# EAGLE design NHK_bldc (EAGLE 9.6.2)
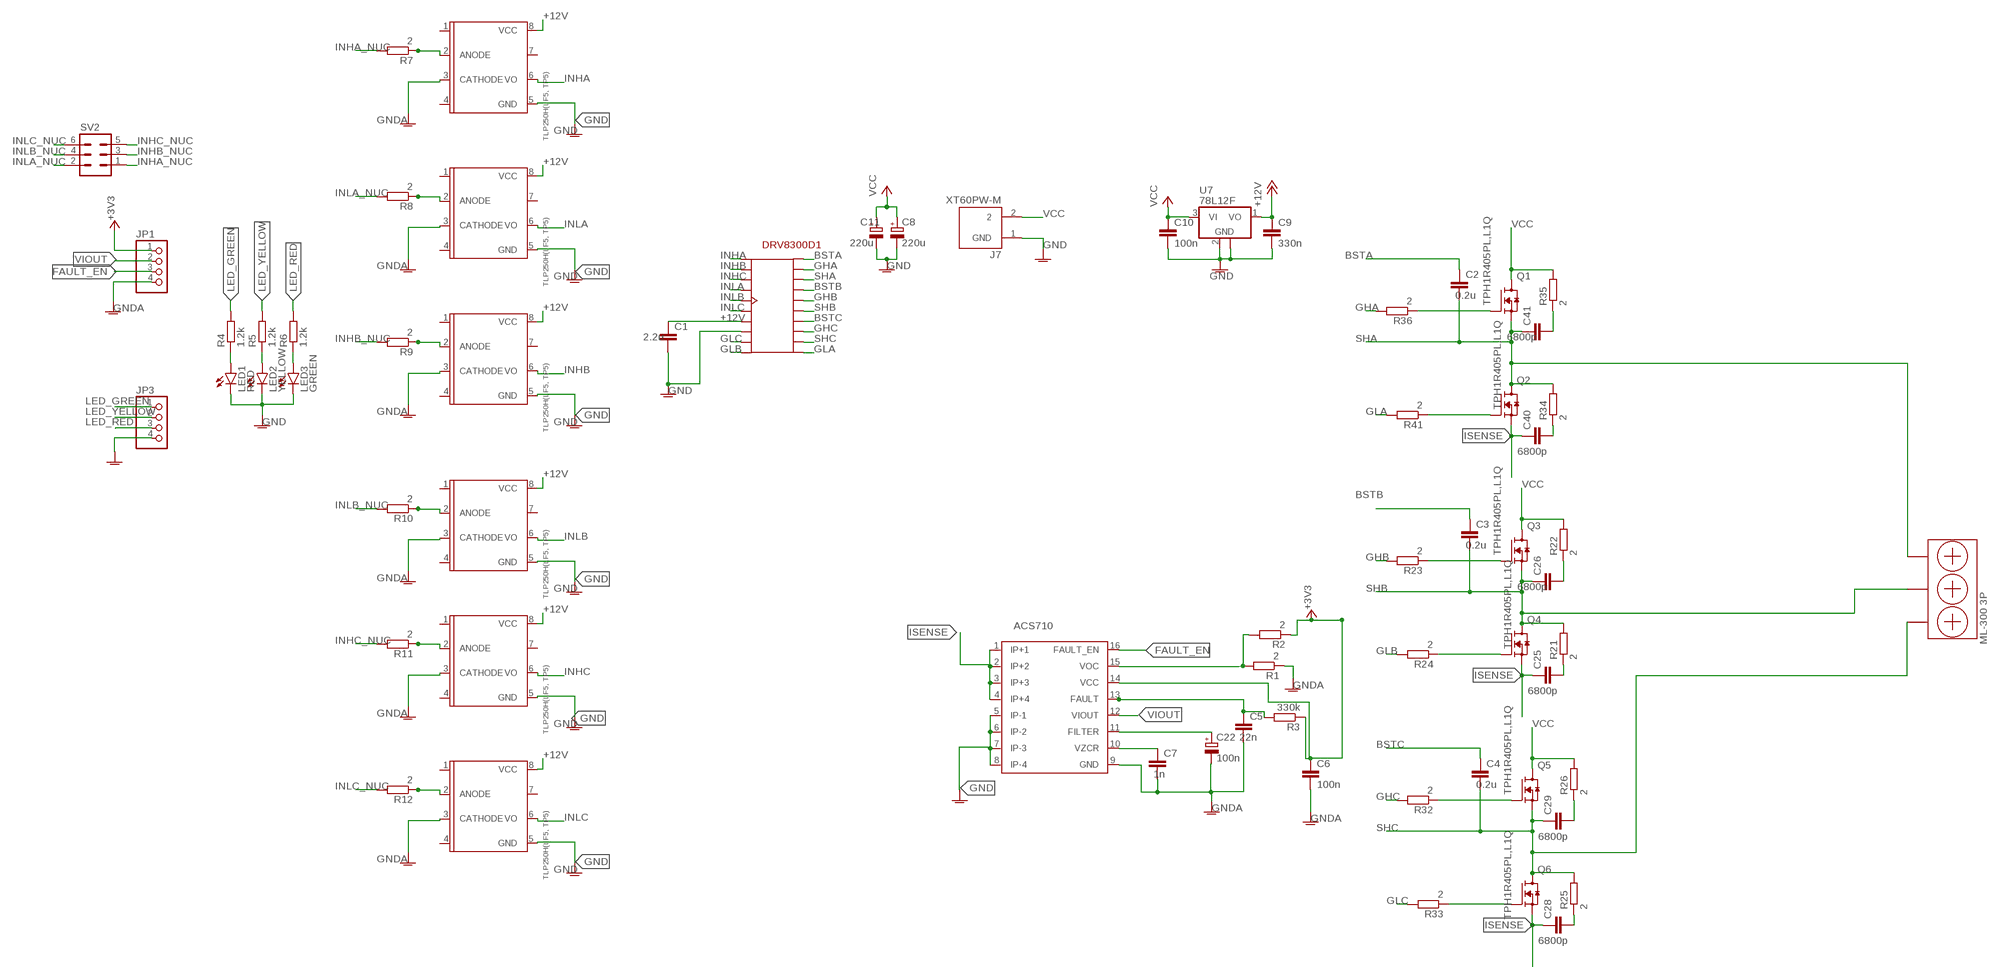
[diagram p0: schematic, sheet 1]

## Parts
C1  2.2u  C-EUC1206  [C1206]
C2  0.2u  C-EUC1206  [C1206]
C3  0.2u  C-EUC1206  [C1206]
C4  0.2u  C-EUC1206  [C1206]
C5  22n  C-EUC0603  [C0603]
C6  100n  C-EUC0603  [C0603]
C7  1n  C-EUC0603  [C0603]
C8  220u  CPOL-EUE5-10.5  [E5-10,5]
C9  330n  C-EUC0603  [C0603]
C10  100n  C-EUC0603  [C0603]
C11  220u  CPOL-EUE5-10.5  [E5-10,5]
C22  100n  CPOL-EUE2.5-5  [E2,5-5]
C25  6800p  C-EUC0603  [C0603]
C26  6800p  C-EUC0603  [C0603]
C28  6800p  C-EUC0603  [C0603]
C29  6800p  C-EUC0603  [C0603]
C40  6800p  C-EUC0603  [C0603]
C41  6800p  C-EUC0603  [C0603]
DRV8300D1  DRV8300D  [DRV8300D]
J7  XT60PW-M  [AMASS_XT60PW-M]
JP1  PINHD-1X4  [1X04]
JP3  PINHD-1X4  [1X04]
LED1  RED  LEDCHIP-LED0603  [CHIP-LED0603]
LED2  YELLOW  LEDCHIP-LED0603  [CHIP-LED0603]
LED3  GREEN  LEDCHIP-LED0603  [CHIP-LED0603]
ML-300-3P1  ML-300-3P  [ML300-3P]
Q1  TPH1R405PL,L1Q  [SOPADVANCE]
Q2  TPH1R405PL,L1Q  [SOPADVANCE]
Q3  TPH1R405PL,L1Q  [SOPADVANCE]
Q4  TPH1R405PL,L1Q  [SOPADVANCE]
Q5  TPH1R405PL,L1Q  [SOPADVANCE]
Q6  TPH1R405PL,L1Q  [SOPADVANCE]
R1  2  R-EU_R0603  [R0603]
R2  2  R-EU_R0603  [R0603]
R3  330k  R-EU_R0603  [R0603]
R4  1.2k  R-EU_R0603  [R0603]
R5  1.2k  R-EU_R0603  [R0603]
R6  1.2k  R-EU_R0603  [R0603]
R7  2  R-EU_R0603  [R0603]
R8  2  R-EU_R0603  [R0603]
R9  2  R-EU_R0603  [R0603]
R10  2  R-EU_R0603  [R0603]
R11  2  R-EU_R0603  [R0603]
R12  2  R-EU_R0603  [R0603]
R21  2  R-EU_R0603  [R0603]
R22  2  R-EU_R0603  [R0603]
R23  2  R-EU_R0603  [R0603]
R24  2  R-EU_R0603  [R0603]
R25  2  R-EU_R0603  [R0603]
R26  2  R-EU_R0603  [R0603]
R32  2  R-EU_R0603  [R0603]
R33  2  R-EU_R0603  [R0603]
R34  2  R-EU_R0603  [R0603]
R35  2  R-EU_R0603  [R0603]
R36  2  R-EU_R0603  [R0603]
R41  2  R-EU_R0603  [R0603]
SV2  MA03-2  [MA03-2]
U7  78L12F  [SOT89]
U8  TLP250H(LF5,TP5)  [TLP250H(LF5,TP5)]
U9  TLP250H(LF5,TP5)  [TLP250H(LF5,TP5)]
U10  TLP250H(LF5,TP5)  [TLP250H(LF5,TP5)]
U11  TLP250H(LF5,TP5)  [TLP250H(LF5,TP5)]
U12  TLP250H(LF5,TP5)  [TLP250H(LF5,TP5)]
U14  TLP250H(LF5,TP5)  [TLP250H(LF5,TP5)]
U$1  ACS710  [ACS710]

## Nets
+3V3: C6.1 JP1.1 R2.1 R3.1 U$1.14(VCC)
+12V: C1.1 C9.1 DRV8300D1.GVDD U7.1(VO) U8.8(VCC) U9.8(VCC) U10.8(VCC) U11.8(VCC) U12.8(VCC) U14.8(VCC)
AHG1: Q1.4(G) R36.1
AHG3: Q3.4(G) R23.1
AHG4: Q5.4(G) R32.1
ALG1: Q2.4(G) R41.1
ALG3: Q4.4(G) R24.1
ALG4: Q6.4(G) R33.1
BSTA: C2.1 DRV8300D1.BSTA
BSTB: C3.1 DRV8300D1.BSTB
BSTC: C4.1 DRV8300D1.BSTC
FAULT_EN: JP1.3 U$1.16(FAULT_EN)
GHA: DRV8300D1.GHA R36.2
GHB: DRV8300D1.GHB R23.2
GHC: DRV8300D1.GHC R32.2
GLA: DRV8300D1.GLA R41.2
GLB: DRV8300D1.GLB R24.2
GLC: DRV8300D1.GLC R33.2
GND: C1.2 C8.- C9.2 C10.2 C11.- DRV8300D1.GND J7.1(GND) LED1.C LED2.C LED3.C U7.2(GND) U7.2@1(GND) U8.5(GND) U9.5(GND) U10.5(GND) U11.5(GND) U12.5(GND) U14.5(GND) U$1.5(IP-1) U$1.6(IP-2) U$1.7(IP-3) U$1.8(IP-4) ; supply symbol labelled GNDA
GNDA: C5.2 C6.2 C7.2 C22.- JP1.4 JP3.4 R1.1 U8.3(CATHODE) U9.3(CATHODE) U10.3(CATHODE) U11.3(CATHODE) U12.3(CATHODE) U14.3(CATHODE) U$1.9(GND)
INHA: DRV8300D1.INHA U8.6(VO)
INHA_NUC: R7.2 SV2.1
INHB: DRV8300D1.INHB U10.6(VO)
INHB_NUC: R9.2 SV2.3
INHC: DRV8300D1.INHC U12.6(VO)
INHC_NUC: R11.2 SV2.5
INLA: DRV8300D1.INLA U9.6(VO)
INLA_NUC: R8.2 SV2.2
INLB: DRV8300D1.INLB U11.6(VO)
INLB_NUC: R10.2 SV2.4
INLC: DRV8300D1.INLC U14.6(VO)
INLC_NUC: R12.2 SV2.6
ISENSE: C25.1 C28.1 C40.1 Q2.1(S) Q2.2(S) Q2.3(S) Q4.1(S) Q4.2(S) Q4.3(S) Q6.1(S) Q6.2(S) Q6.3(S) U$1.1(IP+1) U$1.2(IP+2) U$1.3(IP+3) U$1.4(IP+4)
LED_GREEN: JP3.1 R4.2
LED_RED: JP3.3 R6.2
LED_YELLOW: JP3.2 R5.2
N$1: LED1.A R4.1
N$2: LED2.A R5.1
N$3: R1.2 R2.2 U$1.15(VOC)
N$4: C5.1 R3.2 U$1.13(FAULT)
N$5: C7.1 U$1.10(VZCR)
N$6: LED3.A R6.1
N$7: R7.1 U8.2(ANODE)
N$8: R8.1 U9.2(ANODE)
N$9: R9.1 U10.2(ANODE)
N$10: R10.1 U11.2(ANODE)
N$11: R11.1 U12.2(ANODE)
N$12: R12.1 U14.2(ANODE)
N$17: C22.+ U$1.11(FILTER)
N$36: C25.2 R21.1
N$37: C26.2 R22.1
N$39: C28.2 R25.1
N$40: C29.2 R26.1
N$42: C40.2 R34.1
N$43: C41.2 R35.1
SHA: C2.2 C41.1 DRV8300D1.SHA ML-300-3P1.P$1 Q1.1(S) Q1.2(S) Q1.3(S) Q2.5(D) Q2.6(D) Q2.7(D) Q2.8(D) Q2.9(D) R34.2
SHB: C3.2 C26.1 DRV8300D1.SHB ML-300-3P1.P$3 Q3.1(S) Q3.2(S) Q3.3(S) Q4.5(D) Q4.6(D) Q4.7(D) Q4.8(D) Q4.9(D) R21.2
SHC: C4.2 C29.1 DRV8300D1.SHC ML-300-3P1.P$5 Q5.1(S) Q5.2(S) Q5.3(S) Q6.5(D) Q6.6(D) Q6.7(D) Q6.8(D) Q6.9(D) R25.2
VCC: C8.+ C10.1 C11.+ J7.2 Q1.5(D) Q1.6(D) Q1.7(D) Q1.8(D) Q1.9(D) Q3.5(D) Q3.6(D) Q3.7(D) Q3.8(D) Q3.9(D) Q5.5(D) Q5.6(D) Q5.7(D) Q5.8(D) Q5.9(D) R22.2 R26.2 R35.2 U7.3(VI)
VIOUT: JP1.2 U$1.12(VIOUT)
Unconnected: U8.1 U8.4 U8.7 U9.1 U9.4 U9.7 U10.1 U10.4 U10.7 U11.1 U11.4 U11.7 U12.1 U12.4 U12.7 U14.1 U14.4 U14.7

## Library data of the parts
C1-C7 C9 C10 C25 C26 C28 C29 C40 C41 = rcl:C-EU: CAPACITOR, European symbol; SPICEPREFIX: C
C8 C11 C22 = rcl:CPOL-EU: POLARIZED CAPACITOR, European symbol; SPICEPREFIX: C
DRV8300D1 = DRV8300D:DRV8300D
J7 = con-xt:XT60PW-M; AVAILABILITY: Unavailable; MF: AMASS; MP: XT60PW-M; PACKAGE: Package Analog Devices; PRICE: None
JP1 JP3 = pinhead:PINHD-1X4: PIN HEADER
LED1-LED3 = led:LED: LED OSRAM: - CHIPLED LG R971, LG N971, LY N971, LG Q971, LY Q971, LO R971, LY R971 LH N974, LH R974 LS Q976, LO Q976, LY Q976 LO Q996 - Hyper CHIPLED LW Q18S LB Q993, LB Q99A, LB R99A - SideLED LS A670, LO A670, LY A670, LG A670, LP A670 LB A673, LV A673, LT A673, LW A673 LH A674 LY A675 LS A676, LA A676, LO A676, LY A676, LW A676 LS A679, LY A679, LG A679 - Hyper Micro SIDELED® LS Y876, LA Y876, LO Y876, LY Y876 LT Y87S - SmartLED LW L88C, LW L88S LB L89C, LB L89S, LG L890 LS L89K, LO L89K, LY L89K LS L896, LA L896, LO L896, LY L896 - TOPLED LS T670, LO T670, LY T670, LG T670, LP T670 LSG T670, LSP T670, LSY T670, LOP T670, LYG T670 LG T671, LOG T671, LSG T671 LB T673, LV T673, LT T673, LW T673 LH T674 LS T676, LA T676, LO T676, LY T676, LB T676, LH T676, LSB T676, LW T676 LB T67C, LV T67C, LT T67C, LS T67K, LO T67K, LY T67K, LW E67C LS E67B, LA E67B, LO E67B, LY E67B, LB E67C, LV E67C, LT E67C LW T67C LS T679, LY T679, LG T679 LS T770, LO T770, LY T770, LG T770, LP T770 LB T773, LV T773, LT T773, LW T773 LH T774 LS E675, LA E675, LY E675, LS T675 LS T776, LA T776, LO T776, LY T776, LB T776 LHGB T686 LT T68C, LB T68C - Hyper Mini TOPLED® LB M676 - Mini TOPLED Santana® LG M470 LS M47K, LO M47K, LY M47K Source: http://www.osram.convergy.de LUXEON: - LUMILED® LXK2-PW12-R00, LXK2-PW12-S00, LXK2-PW14-U00, LXK2-PW14-V00 LXK2-PM12-R00, LXK2-PM12-S00, LXK2-PM14-U00 LXK2-PE12-Q00, LXK2-PE12-R00, LXK2-PE12-S00, LXK2-PE14-T00, LXK2-PE14-U00 LXK2-PB12-K00, LXK2-PB12-L00, LXK2-PB12-M00, LXK2-PB14-N00, LXK2-PB14-P00, LXK2-PB14-Q00 LXK2-PR12-L00, LXK2-PR12-M00, LXK2-PR14-Q00, LXK2-PR14-R00 LXK2-PD12-Q00, LXK2-PD12-R00, LXK2-PD12-S00 LXK2-PH12-R00, LXK2-PH12-S00 LXK2-PL12-P00, LXK2-PL12-Q00, LXK2-PL12-R00 Source: www.luxeon.com KINGBRIGHT: KA-3528ASYC Source: www.kingbright.com
ML-300-3P1 = ML-300-3P:ML-300-3P
Q1-Q6 = toshiba:TPH1R405PL,L1Q; SPICEPREFIX: Q
R1-R12 R21-R26 R32-R36 R41 = rcl:R-EU_: RESISTOR, European symbol; SPICEPREFIX: R
SV2 = con-lstb:MA03-2: PIN HEADER; OC_FARNELL: unknown; OC_NEWARK: unknown
U7 = linear:78L*: POSITOIV-VOLTAGE REGULATORS Output up to 100 mA Source: Datasheet <http://focus.ti.com/lit/ds/symlink/ua78l05.pdf>
U8-U12 U14 = TLP250H(LF5, TP5):TLP250H(LF5,TP5)
U$1 = ACS710:ACS710

## Net classes
1 Power: width 0.8 mm, clearance 1 mm
2 FET: width 0.1 mm, clearance 1 mm

## Board
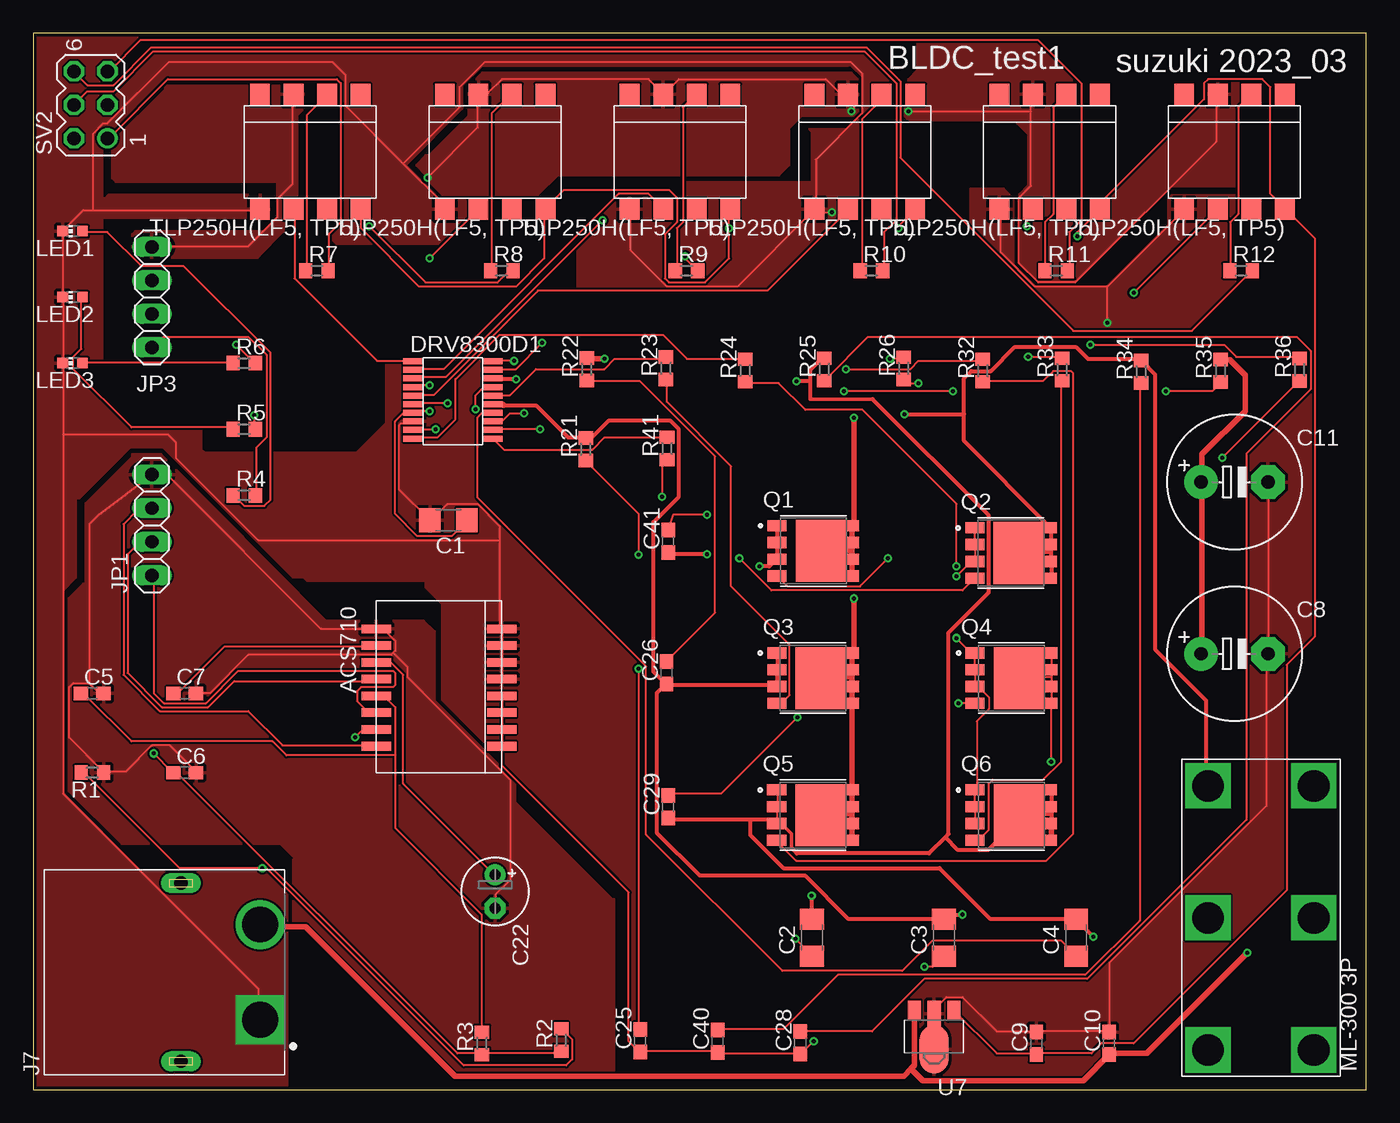
[diagram p1: board, top side]
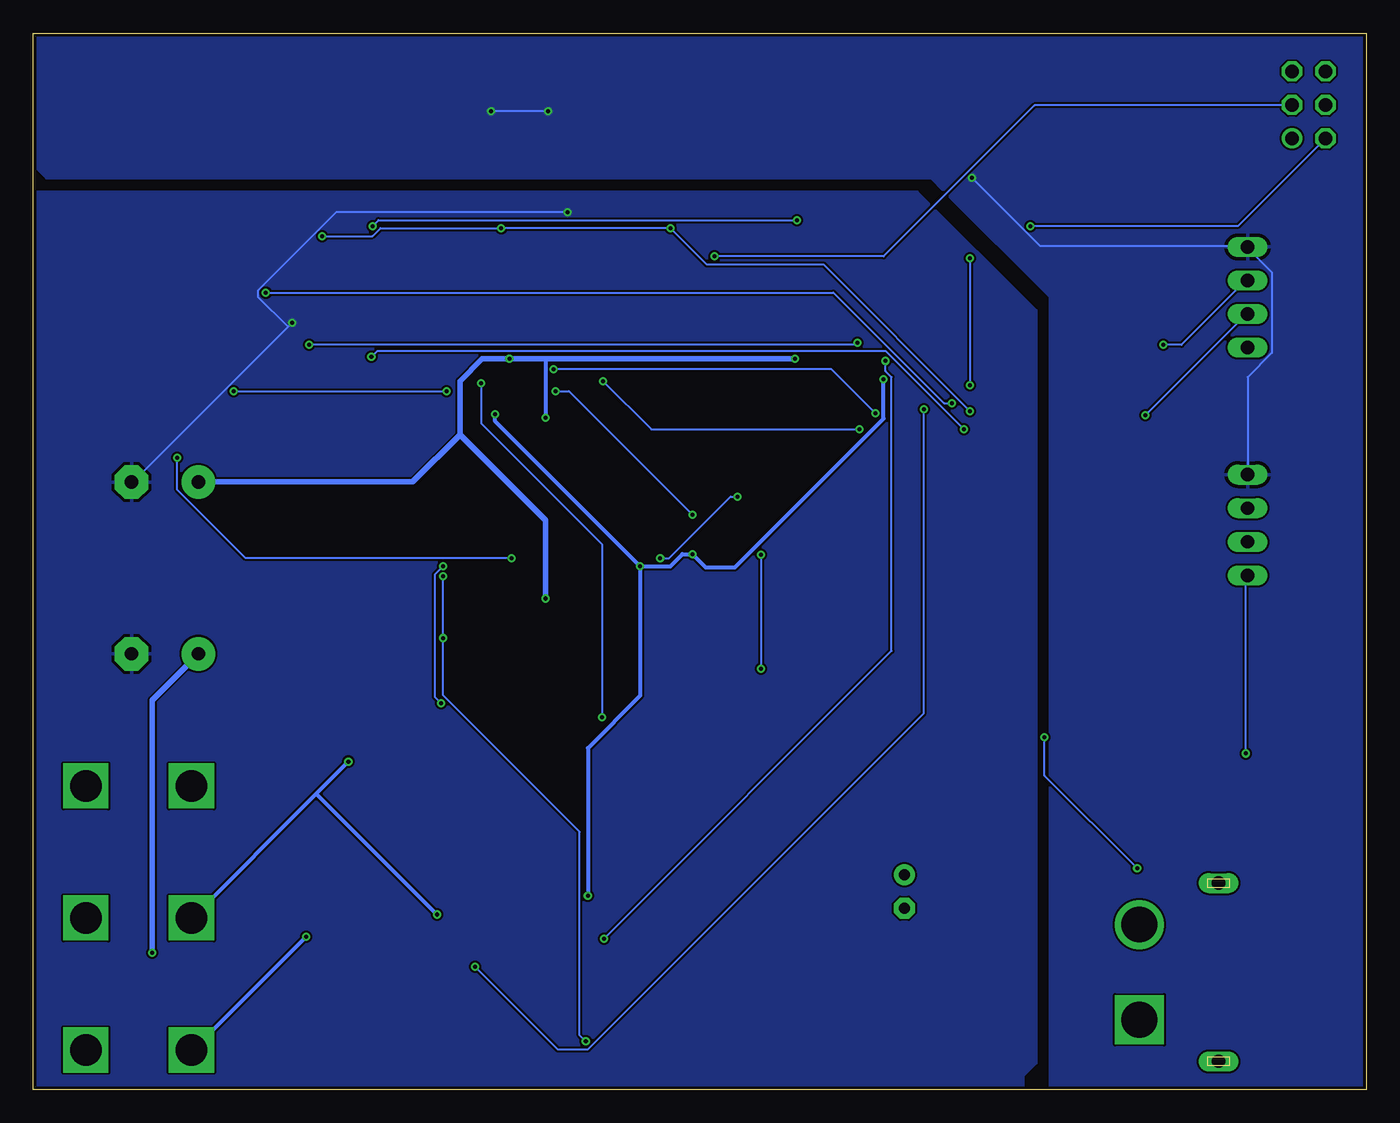
[diagram p2: board, bottom side, seen from below]

Size 101 x 80 mm. Coordinates in mm from the lower left corner, seen from the top.
Outline: 0,0 101,0 101,80 0,80 0,0
Copper layers (1*16): Top 0.035mm / dielectric 1.5mm / Bottom 0.035mm
Design rules "SeeedStudio_2layer_DRU_no_angle_20140221": minimum track width 6mil, minimum drill 12mil, track to track 6mil, track to pad 6mil, pad to pad 6mil, via to via 6mil, smd to smd 0mil, copper to edge 10mil, drill to drill 10mil, minimum pad ring 10mil, minimum via ring 6mil, stop-mask expansion 2mil, vias tented up to drill 100mil, thermal gap 10mil

### Footprints (pad centres in the part's own frame; a part is rotated, then mirrored left to right if it is on the bottom)
C1206 = smd 1.6 x 1.8: 1 -1.4,0; 2 1.4,0
C0603 = smd 1.1 x 1: 1 -0.85,0; 2 0.85,0
E5-10,5 = drill 1.016 pad 2.54: + -2.54,0 | drill 1.016 pad 2.54 octagon: - 2.54,0
E2,5-5 = drill 0.813 pad 1.6: + -1.27,0 | drill 0.813 pad 1.6 octagon: - 1.27,0
DRV8300D = smd 1.5 x 0.45: BSTA 5.25,6.325; BSTB 5.25,4.375; BSTC 5.25,2.425; GHA 5.25,5.675; GHB 5.25,3.725; GHC 5.25,1.775; GLA 5.25,0.475; GLB -0.75,0.475; GLC -0.75,1.125; GND -0.75,1.775; GVDD -0.75,2.425; INHA -0.75,6.325; INHB -0.75,5.675; INHC -0.75,5.025; INLA -0.75,4.375; INLB -0.75,3.725; INLC -0.75,3.075; SHA 5.25,5.025; SHB 5.25,3.075; SHC 5.25,1.125
AMASS_XT60PW-M = drill 2.7 square: 1 -3.6,-6 | drill 2.7: 2 3.6,-6 | drill 1 pad 1.2 long: S1 -6.75,0; S2 6.75,0
1X04 = drill 1.016 long: 1 -3.81,0; 2 -1.27,0; 3 1.27,0; 4 3.81,0
CHIP-LED0603 = smd 0.8 x 0.8: A 0,-0.75; C 0,0.75
ML300-3P = drill 2.4 square: P$1 0,0; P$2 0,8; P$3 10,0; P$4 10,8; P$5 20,0; P$6 20,8
SOPADVANCE = smd 1.45 x 0.85: 1 -2.75,1.905; 2 -2.75,0.635; 3 -2.75,-0.635; 4 -2.75,-1.905 | smd 1.05 x 0.85: 5 2.95,-1.905; 6 2.95,-0.635; 7 2.95,0.635; 8 2.95,1.905 | smd 3.75 x 4.7: 9 0.55,0
R0603 = smd 1 x 1.1: 1 -0.85,0; 2 0.85,0
MA03-2 = drill 1.016: 1 -2.54,-1.27 | drill 1.016 octagon: 2 -2.54,1.27; 3 0,-1.27; 4 0,1.27; 5 2.54,-1.27; 6 2.54,1.27
SOT89 = smd 1 x 1.5: 1 -1.499,-1.981; 3 1.499,-1.981 | smd 1 x 2: 2 0,-1.727 | smd 2.2 x 3.7: 2@1 0,0.94
TLP250H(LF5,TP5) = smd 1.5 x 1.6: 1 -3.81,-4.35; 2 -1.27,-4.35; 3 1.27,-4.35; 4 3.81,-4.35; 5 3.81,4.35; 6 1.27,4.35; 7 -1.27,4.35; 8 -3.81,4.35
ACS710 = smd 0.65 x 2.25: 1 0,0; 2 1.27,0; 3 2.54,0; 4 3.81,0; 5 5.08,0; 6 6.35,0; 7 7.62,0; 8 8.89,0; 9 8.89,9.5; 10 7.62,9.5; 11 6.35,9.5; 12 5.08,9.5; 13 3.81,9.5; 14 2.54,9.5; 15 1.27,9.5; 16 0,9.5

### Placement (x,y rotation side)
C1  31.46,43.12 180 top
C2  59,11.5 90 top
C3  69,11.5 90 top
C4  79,11.5 90 top
C5  4.5,30 0 top
C6  11.5,24 0 top
C7  11.5,30 0 top
C8  91,33 0 top
C9  76,3.5 90 top
C10  81.5,3.5 90 top
C11  91,46 0 top
C22  35,15 270 top
C25  45.99,3.69 90 top
C26  47.99,31.56 90 top
C28  58.11,3.54 90 top
C29  48.11,21.41 90 top
C40  51.86,3.65 90 top
C41  48.11,41.52 90 top
DRV8300D1  29.55,48.82 0 top
J7  11.2,8.89 90 top
JP1  9,42.75 90 top
JP3  9,60 90 top
LED1  3,65 90 top
LED2  3,60 90 top
LED3  3,55 90 top
ML-300-3P1  89,23 270 top
Q1  59.1,40.79 0 top
Q2  74.08,40.63 0 top
Q3  59.09,31.15 0 top
Q4  74.1,31.15 0 top
Q5  59.08,20.79 0 top
Q6  74.09,20.79 0 top
R1  4.5,24 180 top
R2  40,3.75 90 top
R3  34,3.5 90 top
R4  16,45 0 top
R5  16,50 0 top
R6  16,55 0 top
R7  21.5,62 0 top
R8  35.5,62 0 top
R9  49.5,62 0 top
R10  63.5,62 0 top
R11  77.5,62 0 top
R12  91.5,62 0 top
R21  41.86,48.49 90 top
R22  41.94,54.54 90 top
R23  47.94,54.62 90 top
R24  53.94,54.45 90 top
R25  59.94,54.53 90 top
R26  65.94,54.61 90 top
R32  71.94,54.44 90 top
R33  77.94,54.52 90 top
R34  83.94,54.35 90 top
R35  89.94,54.43 90 top
R36  95.94,54.51 90 top
R41  48.02,48.54 90 top
SV2  4.37,74.56 90 top
U7  68.25,4 180 top
U8  21,71 180 top
U9  35,71 180 top
U10  49,71 180 top
U11  63,71 180 top
U12  77,71 180 top
U14  91,71 180 top
U$1  35.5,26 90 top

### Tracks (layer width: path | path; a pad name or v marks a point on that pad's centre or on a via)
+3V3  (via drill 0.3)
  Top 0.152: U$1.14 25.91,28.65 25.3,28.65 24.54,29.41 24.54,30.18 24.84,30.48 27.28,30.48 27.43,30.63 27.43,31.55 27.28,31.7 15.54,31.7 13.11,29.26 9.91,29.26 9.14,30.02 9.14,38.93 JP1.1 | R2.1 39.93,2.9 39.78,2.74 34.14,2.74 R3.1 33.98,2.74 32.16,2.74 10.97,23.93 10.67,23.93 C6.1 10.52,24.08 v9.14,25.45
  Bottom 0.152: v9.14,25.45 9.14,38.93 JP1.1
+12V  (via drill 0.3)
  Top 0.152: C1.1 32.77,42.98 31.7,41.91 29.11,41.91 27.43,43.59 27.43,50.6 28.04,51.21 28.65,51.21 DRV8300D1.GVDD 28.8,51.36 v30.02,51.36 | U8.8 24.84,66.6 24.84,65.23 29.26,60.81 36.58,60.81 38.71,62.94 38.71,66.6 U9.8 38.86,66.75 40.23,68.12 48.16,68.12 48.77,67.51 48.77,65.68 47.85,64.77 47.85,61.42 48.16,61.11 50.9,61.11 52.73,62.94 v52.73,65.23 52.73,66.6 U10.8 | v65.53,65.23 65.53,65.38 66.75,66.6 U11.8 | U7.1 69.8,5.94 73,2.74 75.89,2.74 C9.1 76.05,2.74 80.16,2.74 80.92,3.5 83.36,3.5 94.94,15.09 94.94,32.16 97.08,34.29 97.08,64.47 94.94,66.6 U14.8 94.79,66.75 93.73,67.82 93.73,75.89 93.12,76.5 89,76.5 88.7,76.2 88.7,74.98 80.92,67.21 80.92,66.75 U12.8 80.77,66.6 79.1,64.92 v79.1,64.62
  Bottom 0.152: v30.02,51.36 41.15,62.48 49.99,62.48 v52.73,65.23 v65.53,65.23 74.68,65.23 75.29,64.62 v79.1,64.62
AHG1  (via drill 0.3)
  Top 0.152: v90.07,47.85 95.86,53.65 R36.1 | v64.77,40.23 62.64,38.1 57.15,38.1 56.39,38.86 Q1.4
  Bottom 0.152: v90.07,47.85 90.07,45.41 84.89,40.23 v64.77,40.23
AHG3
  Top 0.152: R23.1 48.01,53.65 48.01,52.07 52.88,47.19 52.88,38.1 57.3,33.68 57.3,29.87 56.69,29.26 56.39,29.26 Q3.4
AHG4
  Top 0.152: R32.1 72.08,53.65 76.5,53.65 77.27,54.41 78.64,54.41 78.79,54.25 78.79,19.36 76.77,17.33 57.8,17.33 56.39,18.75 Q5.4
ALG1  (via drill 0.3)
  Top 0.152: R41.1 47.66,47.33 v47.66,44.9 | v53.49,40.23 55.93,37.8 70.41,37.8 71.32,38.71 Q2.4
  Bottom 0.152: v47.66,44.9 48.16,44.9 52.83,40.23 v53.49,40.23
ALG3  (via drill 0.3)
  Top 0.152: v69.95,39.62 69.95,44.35 62.83,51.47 58.49,51.47 56.47,53.49 53.95,53.49 R24.1 | v70.1,29.26 71.32,29.26 Q4.4
  Bottom 0.152: v69.95,39.62 70.56,39.01 70.56,29.72 v70.1,29.26
ALG4
  Top 0.152: R33.1 77.88,53.65 77.88,24.84 76.5,23.47 72.69,23.47 72.39,23.16 72.39,19.66 71.48,18.75 Q6.4
BSTA  (via drill 0.3)
  Top 0.152: v36.42,55.17 34.9,55.17 DRV8300D1.BSTA | v57.76,11.43 58.98,10.21 C2.1
  Bottom 0.152: v36.42,55.17 36.42,54.41 35.97,53.95 35.97,33.22 v57.76,11.43
BSTB  (via drill 0.3)
  Top 0.152: v33.53,51.51 33.53,52.58 34.14,53.19 34.75,53.19 DRV8300D1.BSTB | v67.51,9.3 68.12,9.3 68.89,10.06 C3.1
  Bottom 0.152: v33.53,51.51 33.53,28.5 58.98,3.05 61.27,3.05 v67.51,9.3
BSTC
  Top 0.152: DRV8300D1.BSTC 34.75,51.21 33.98,51.21 33.68,50.9 33.68,44.81 46.44,32.05 46.44,19.31 56.76,8.99 65.84,8.99 68.12,11.28 77.88,11.28 78.94,10.21 C4.1
FAULT_EN
  Top 0.152: U$1.16 25.91,26.06 18.9,26.06 16.31,28.65 9.6,28.65 6.86,31.39 6.86,42.82 7.91,43.87 JP1.3
GHA  (via drill 0.3)
  Top 0.152: v80.1,56.39 90.22,56.39 91.14,55.47 95.86,55.47 R36.2 | v38.56,56.54 36.58,54.56 34.9,54.56 DRV8300D1.GHA
  Bottom 0.152: v80.1,56.39 38.71,56.39 v38.56,56.54
GHB
  Top 0.152: R23.2 47.85,55.32 44.04,55.32 43.28,54.56 38.1,54.56 36.12,52.58 34.9,52.58 DRV8300D1.GHB
GHC  (via drill 0.3)
  Top 0.152: v61.57,54.56 66.45,54.56 67.06,55.17 71.93,55.17 R32.2 | v37.19,51.21 36.12,51.21 35.51,50.6 34.9,50.6 DRV8300D1.GHC
  Bottom 0.152: v61.57,54.56 40.54,54.56 v37.19,51.21
GLA
  Top 0.152: R41.2 48.01,49.38 43.28,49.38 42.37,48.46 35.66,48.46 34.9,49.23 DRV8300D1.GLA
GLB
  Top 0.152: R24.2 53.8,55.32 49.53,55.32 47.7,57.15 35.36,57.15 32,53.8 32,50.75 30.63,49.38 28.8,49.38 DRV8300D1.GLB
GLC  (via drill 0.3)
  Top 0.152: v75.37,55.47 77.88,55.47 R33.2 | v30.48,49.99 28.8,49.99 DRV8300D1.GLC
  Bottom 0.152: v75.37,55.47 74.91,55.93 36.42,55.93 v30.48,49.99
GND  (via drill 0.3)
  Top 0.152: U7.2@1 68.28,3.2 68.28,5.64 U7.2 68.28,5.79 68.28,6.1 69.19,7.01 70.41,7.01 73,4.42 75.89,4.42 C9.2 76.05,4.42 81.38,4.42 C10.2 81.53,4.42 81.53,9.6 93.42,21.49 93.42,32.92 C8.- 93.57,33.07 93.57,45.87 C11.- | 81.38,60.81 75.89,60.81 73.3,63.4 73.3,66.6 U12.5 | 81.38,60.81 87.17,66.6 U14.5 | v81.38,58.06 81.38,60.81 | U$1.5 35.51,32.31 U$1.6 35.51,32.46 35.51,33.53 U$1.7 35.51,33.68 35.51,34.75 U$1.8 35.36,34.9 35.36,41.6 | DRV8300D1.GND 28.65,50.44 27.89,50.44 27.74,50.29 27.74,45.41 30.02,43.13 C1.2 30.18,43.13 31.39,44.35 33.68,44.35 35.36,42.67 35.36,41.6 | U10.5 45.26,66.6 45.26,63.55 48.01,60.81 53.34,60.81 59.13,66.6 U11.5 | 4.57,66.6 3.81,66.6 2.29,65.08 LED1.C 2.29,64.92 2.29,60.05 LED2.C 2.29,59.89 2.29,55.02 LED3.C 2.29,54.86 2.29,49.62 | 4.57,66.6 17.07,66.6 U8.5 | 28.04,70.1 23.62,74.52 23.62,76.85 22.66,77.81 10.3,77.81 5.64,73.15 5.33,73.15 4.57,72.39 4.57,66.6 | 28.04,70.1 31.09,67.06 31.09,66.75 U9.5 | 2.29,49.62 2.29,22.4 17.07,7.62 17.07,5.33 J7.1 | 28.04,70.1 32.31,74.37 32.31,75.89 34.22,77.81 61.93,77.81 62.79,76.95 62.79,73.91 59.28,70.41 59.28,66.75 U11.5 | 35.36,41.6 17.07,41.6 10.82,47.85 10.82,49.01 10.21,49.62 2.29,49.62 | v60.5,66.45 59.44,66.45 59.28,66.6 U11.5
  Bottom 0.152: 81.69,57.76 93.42,46.02 C11.- | 81.69,57.76 v81.38,58.06 | 81.69,57.76 83.97,60.05 83.97,60.5 78.03,66.45 v60.5,66.45
  pour Top: 0,80 62,80 65.5,76.5 65.5,60.75 64.25,59.5 42.25,59.5 41.25,60.5 41.25,67.5 42.5,68.75 59,68.75 59,72.5 58.75,72.75 61.8,72.75 62.85,73.8 62.85,76.65 62,77.5 62,77.75 61.75,77.5 34,77.5 32.5,76 32.5,74.25 28.25,70 30.85,67.4 33,67.4 33,64.75 32.25,64 23,64 21.25,65.75 21.25,76.25 20.75,76.75 10.25,76.75 5.5,72 5.25,72 5.25,52 12.5,52 12.75,51.75 12.75,48.5 13,48.25 24.5,48.25 26.75,50.5 26.75,57 28.25,58.5 67.5,58.5 71,62 71,68.25 73.5,68.25 74.25,67.5 74.25,62.5 76,60.75 81.25,60.75 86,65.5 86,67.5 86.25,67.75 99.75,67.75 101,66.5 101,0 44.5,0 44.5,16 31,29.5 31,36.75 29.75,38 29.75,38.5 20.75,38.5 20.5,38.75 19.7,38.75 9.85,48.6 7.35,48.6 3.5,44.75 3.25,44.75 3.25,38.75 2.25,37.75 2.25,22.5 8.25,16.5 19.25,16.5 19.25,0 0,0
  pour Top: 5.5,67.5 5.75,67.75 17.9,67.75 17.9,66 5.25,66 5.25,67.5
  pour Bottom: 101,68 101,0 26,0 26,1 25,2 25,59 34,68
GNDA  (via drill 0.3)
  Top 0.152: 75.59,74.07 75.59,68.43 74.68,67.51 74.68,62.58 76.15,61.11 78.94,61.11 89.61,71.78 89.61,75.29 U14.3 | 75.59,74.07 75.59,75.29 U12.3 | v66.29,74.07 75.59,74.07 | v61.98,74.07 62.18,74.27 62.18,74.98 61.87,75.29 U11.3 61.72,75.44 61.11,75.44 60.05,76.5 48.92,76.5 47.85,75.44 U10.3 47.7,75.44 46.63,76.5 35.51,76.5 34.44,75.44 33.83,75.44 U9.3 33.68,75.29 33.68,72.85 v29.87,69.04 | 27.28,33.07 27.43,33.22 27.43,33.98 26.67,34.75 26.06,34.75 U$1.9 25.91,34.9 21.79,34.9 10.23,46.46 JP1.4 5.01,43.57 4.27,42.82 4.27,30.79 | 27.28,33.07 27.13,32.92 16.31,32.92 13.41,30.02 12.5,30.02 C7.2 | 27.28,33.07 28.35,32 28.35,31.24 36.12,23.47 36.12,15.85 35.05,14.78 35.05,13.87 C22.- | C6.2 12.34,24.08 10.36,26.06 8.99,26.06 7.01,24.08 5.49,24.08 R1.1 5.33,24.08 2.74,26.67 2.74,30.48 3.05,30.79 4.27,30.79 | 4.27,30.79 5.03,30.02 5.33,30.02 C5.2 | U8.3 19.66,75.29 19.66,68.58 18.54,67.46 18.54,66.09 16.31,63.86 9.14,63.86 JP3.4
  Bottom 0.152: v61.98,74.07 v66.29,74.07 | JP1.4 8.99,46.7 8.99,53.95 7.16,55.78 7.16,61.87 8.99,63.7 JP3.4 9.14,63.86 24.69,63.86 v29.87,69.04
  pour Top: 29,70 29.75,69.25 29.75,69 31,67.75 38.25,67.75 39.75,69.25 56.5,69.25 57.25,70 57.25,72.75 58.25,73.75 62.25,73.75 62.5,74 62.5,76.5 62,77 34,77 33,76 33,73.75 30,70.75 29.75,70.75
  pour Top: 10,76 20.5,76 20.5,74.75 20.75,74.5 20,73.75 20,67.5 19,66.5 19,65 17,63 7.75,63 7.5,63.25 7.5,64.75 7.75,65 17.5,65 18.5,66 18.5,68.75 6.25,68.75 6,69 6,71.75 10,75.75
  pour Top: 66.2,74.5 65.9,74.2 65.9,73.8 66.2,73.5 66.3,73.5 66.4,73.4 74.3,73.4 75.4,72.3 75.4,68.5 74.7,67.8 74.7,62.6 76.2,61.1 76.2,61.1 78.9,61.1 86.2,68.4 100.3,68.4 100.3,79.4 100.6,79.7 67.2,79.7 67,79.5 67,77.2 66.3,76.5 66.3,74.7 66.2,74.6
  pour Top: 7.5,48.1 9.7,48.1 22.2,35.5 22.2,35.5 29.6,35.5 30.4,34.7 30.4,29.5 36.4,23.5 36.5,23.5 36.5,21.8 43.9,14.4 44,14.4 44,0.2 44.1,0.1 19.7,0.1 19.7,17.4 19.8,17.5 18.7,18.6 6.7,18.6 2.7,22.6 2.7,37.2 3.8,38.3 4,38.3 4,44.4 7.5,47.9
  pour Bottom: 0,0 0,80 101,80 101,70 100,69 33,69 32,68 24,60 24,0
INHA
  Top 0.152: DRV8300D1.INHA 28.65,55.17 26.06,55.17 19.81,61.42 19.81,66.6 U8.6
INHA_NUC
  Top 0.152: R7.2 22.4,62.03 22.4,64.77 23.32,65.68 23.32,76.2 23.01,76.5 10.21,76.5 5.79,72.08 SV2.1
INHB
  Top 0.152: DRV8300D1.INHB 28.8,54.56 31.09,54.56 44.35,67.82 46.63,67.82 47.7,66.75 U10.6
INHB_NUC  (via drill 0.3)
  Top 0.152: v49.38,63.09 49.38,62.94 50.29,62.03 R9.2
  Bottom 0.152: v49.38,63.09 36.58,63.09 25.15,74.52 5.79,74.52 SV2.3
INHC  (via drill 0.3)
  Top 0.152: v43.13,65.84 31.24,53.95 28.8,53.95 DRV8300D1.INHC | v75.29,65.38 75.29,66.29 75.59,66.6 U12.6
  Bottom 0.152: v43.13,65.84 74.83,65.84 v75.29,65.38
INHC_NUC
  Top 0.152: R11.2 78.49,62.03 78.49,64.92 79.4,65.84 79.4,76.2 76.13,79.47 8.15,79.47 5.79,77.11 SV2.5
INLA  (via drill 0.3)
  Top 0.152: v30.02,53.34 28.8,53.34 DRV8300D1.INLA | v30.02,62.94 33.68,66.6 U9.6
  Bottom 0.152: v30.02,62.94 v30.02,53.34
INLA_NUC  (via drill 0.3)
  Top 0.152: v25.45,65.38 29.72,61.11 35.2,61.11 35.97,61.87 36.27,61.87 R8.2
  Bottom 0.152: v25.45,65.38 9.75,65.38 3.2,71.93 SV2.2
INLB
  Top 0.152: DRV8300D1.INLB 28.8,52.58 30.33,52.58 38.25,60.5 55.63,60.5 61.72,66.6 U11.6
INLB_NUC
  Top 0.152: R10.2 64.47,62.03 64.47,64.92 65.38,65.84 65.38,76.2 62.97,78.61 9.12,78.61 6.1,75.59 4.12,75.59 3.2,74.68 SV2.4
INLC  (via drill 0.3)
  Top 0.152: v31.39,51.97 28.8,51.97 DRV8300D1.INLC | v83.36,60.35 89.61,66.6 U14.6
  Bottom 0.152: v31.39,51.97 32,51.97 40.39,60.35 v83.36,60.35
INLC_NUC
  Top 0.152: R12.2 92.2,61.87 87.78,57.45 78.79,57.45 65.68,70.56 65.68,76.35 63.12,78.92 8.97,78.92 6.1,76.05 4.12,76.05 3.2,76.96 SV2.6
ISENSE  (via drill 0.3)
  Top 0.152: Q2.1 71.32,42.52 71.32,41.3 Q2.2 71.32,41.15 71.32,40.08 Q2.3 71.32,39.93 71.02,39.93 v69.95,38.86 | Q6.3 71.32,20.27 71.32,21.34 Q6.2 71.32,21.49 71.32,22.55 Q6.1 71.48,22.71 71.48,27.89 72.39,28.8 72.39,29.72 71.48,30.63 Q4.3 71.32,30.63 71.32,31.7 Q4.2 71.32,31.85 71.32,32.92 Q4.1 70.71,33.43 v69.95,34.19 | U$1.4 35.51,29.72 35.51,28.65 U$1.3 35.51,28.5 U$1.2 35.51,27.13 35.51,26.06 U$1.1 35.51,25.91 35.51,24.54 45.11,14.94 45.11,3.66 45.87,2.9 C25.1 46.02,2.9 51.82,2.9 C40.1 51.97,2.74 58.06,2.74 C28.1 58.22,2.74 v59.13,3.66
  Bottom 0.152: v69.95,38.86 v69.95,34.19 69.95,29.87 59.59,19.51 59.59,4.12 v59.13,3.66
LED_GREEN
  Top 0.152: R4.2 16.92,45.11 16.92,48.62 17.68,49.38 17.68,55.63 16.31,57 9.91,57 9.14,56.24 JP3.1
LED_RED  (via drill 0.3)
  Top 0.152: v15.39,56.39 16.76,55.02 R6.2
  Bottom 0.152: v15.39,56.39 14.02,56.39 9.14,61.27 JP3.3
LED_YELLOW  (via drill 0.3)
  Top 0.152: v16.76,51.05 16.76,50.14 R5.2
  Bottom 0.152: v16.76,51.05 9.14,58.67 JP3.2
N$1
  Top 0.152: LED1.A 3.81,64.92 5.64,64.92 8.23,62.33 11.43,62.33 17.98,55.78 17.98,44.65 17.53,44.2 16,44.2 15.24,44.96 R4.1
N$2
  Top 0.152: LED2.A 3.66,59.89 3.66,56.08 3.05,55.47 3.05,54.56 7.47,50.14 15.09,50.14 R5.1
N$3  (via drill 0.3)
  Top 0.152: R1.2 3.66,23.93 3.96,23.93 11.12,16.76 v17.37,16.76 17.68,16.76 32.61,1.83 40.39,1.83 40.84,2.29 40.84,3.81 40.08,4.57 R2.2 | v24.38,26.67 24.84,27.13 25.91,27.13 U$1.15
  Bottom 0.152: v24.38,26.67 24.38,23.77 v17.37,16.76
N$4
  Top 0.152: 27.43,25.3 27.43,28.96 26.67,29.72 26.06,29.72 U$1.13 | 27.43,25.3 27.43,19.81 33.98,13.26 33.98,4.42 R3.2 | 27.43,25.3 19.2,25.3 18.14,26.36 7.47,26.36 3.96,29.87 3.66,29.87 C5.1
N$5
  Top 0.152: C7.1 10.67,30.02 10.97,30.02 14.48,33.53 25.91,33.53 U$1.10
N$6
  Top 0.152: LED3.A 3.81,55.02 15.09,55.02 R6.1
N$7
  Top 0.152: R7.1 20.73,62.03 20.73,73.76 22.25,75.29 U8.2
N$8
  Top 0.152: R8.1 34.75,62.03 34.75,73.91 36.12,75.29 U9.2
N$9
  Top 0.152: R9.1 48.77,62.03 48.77,65.23 49.23,65.68 49.23,74.37 50.14,75.29 U10.2
N$10
  Top 0.152: R10.1 62.79,62.03 62.79,73.46 64.16,74.83 64.16,75.29 U11.2
N$11
  Top 0.152: R11.1 76.66,62.03 76.66,65.68 77.27,66.29 77.27,74.37 78.18,75.29 U12.2
N$12
  Top 0.152: R12.1 90.68,62.03 90.68,65.68 91.29,66.29 91.29,74.37 92.2,75.29 U14.2
N$17
  Top 0.152: U$1.11 26.06,32.31 27.13,32.31 28.04,31.39 28.04,23.16 34.9,16.31 C22.+
N$36  (via drill 0.3)
  Top 0.152: v45.87,31.85 45.87,4.57 C25.2 | v45.87,40.5 45.87,43.59 41.91,47.55 R21.1
  Bottom 0.152: v45.87,40.5 v45.87,31.85
N$37
  Top 0.152: R22.1 42.06,53.65 45.97,53.65 51.66,47.95 51.66,36.12 48.01,32.46 C26.2
N$39
  Top 0.152: C28.2 58.22,4.42 63.55,4.42 67.51,8.38 79.86,8.38 91.9,20.42 91.9,48.16 96.77,53.03 96.77,55.93 95.71,57 63.25,57 60.05,53.8 R25.1
N$40  (via drill 0.3)
  Top 0.152: v57.91,28.19 52.12,22.4 48.16,22.4 C29.2 | v67.06,53.49 66.14,53.49 65.99,53.65 R26.1
  Bottom 0.152: v57.91,28.19 57.91,41.3 67.06,50.44 v67.06,53.49
N$42
  Top 0.152: C40.2 51.97,4.57 56.84,4.57 60.96,8.69 79.7,8.69 83.82,12.8 83.82,53.49 R34.1
N$43  (via drill 0.3)
  Top 0.152: v51.05,43.52 48.48,43.52 C41.2 | v69.66,52.88 v61.42,52.88 | v85.8,52.88 89.31,52.88 89.92,53.49 R35.1
  Bottom 0.152: v61.42,52.88 60.42,52.88 v51.05,43.52 | v85.8,52.88 v69.66,52.88
SHA  (via drill 0.3)
  Top 0.152: 77.11,38.86 Q2.5 | 77.11,39.93 Q2.6 77.11,40.08 | 77.11,41.15 Q2.7 77.11,41.3 | 77.11,42.52 Q2.8 76.96,42.67 | 83.82,55.32 R34.2 83.97,55.17 | 74.68,40.69 Q2.9 | 88.85,23.01 ML-300-3P1.P$1 | 48.16,40.54 C41.1 | 56.24,40.08 Q1.3 56.39,40.23 | 56.39,41.3 Q1.2 56.39,41.45 | 56.39,42.67 Q1.1 | 34.9,53.8 DRV8300D1.SHA | 58.98,12.95 C2.2
  Top 0.305: 77.11,39.93 77.11,38.86 | 77.11,40.08 77.11,40.69 | 77.11,40.69 77.11,41.15 | 77.11,41.3 77.11,42.52 | 83.82,55.32 79.9,55.32 78.99,56.24 74.37,56.24 72.54,54.41 71.07,54.41 70.52,53.85 70.52,51.14 | 70.52,51.14 70.52,49.12 76.96,42.67 | 77.11,40.69 74.68,40.69 | 88.85,23.01 88.85,29.48 84.98,33.34 84.98,54.16 83.97,55.17 | v51.05,40.54 48.16,40.54 | v55.02,39.62 55.78,39.62 56.24,40.08 | 56.39,40.23 56.39,41.3 | 56.39,41.45 56.39,42.67 | v36.58,53.8 34.9,53.8 | v58.98,14.69 58.98,12.95 | v65.99,51.14 70.52,51.14
  Bottom 0.305: v55.02,39.62 52.73,39.62 51.82,40.54 v51.05,40.54 50.05,39.54 47.84,39.54 36.58,50.8 v36.58,53.8 | v58.98,14.69 58.98,25.86 55.02,29.83 v55.02,39.62 | v65.99,51.14 65.99,50.6 v55.02,39.62
SHB  (via drill 0.3)
  Top 0.152: Q4.8 77.11,32.92 77.11,31.85 Q4.7 77.11,31.7 77.11,31.24 | 77.11,31.24 77.11,30.63 Q4.6 77.11,30.48 77.11,29.26 Q4.5 77.11,29.11 v77.11,24.84 | 77.11,31.24 74.68,31.24 Q4.9 | 41.76,49.38 R21.2 41.91,49.38 | 56.39,31.85 Q3.2 56.39,31.7 | 56.39,32.92 Q3.1 | 48.01,30.63 C26.1 | 56.24,30.63 Q3.3 56.39,30.63 | 68.89,12.95 C3.2 69.04,12.95 | 47.85,30.63 C26.1 | 47.85,30.79 C26.1
  Top 0.305: 41.76,49.38 40.53,49.38 38.09,51.82 35.65,51.82 | 56.39,32.92 56.39,31.85 | 56.24,30.63 48.01,30.63 | 68.89,12.95 61.72,12.95 58.45,16.22 50.49,16.22 47.24,19.46 47.24,30.02 47.85,30.63 | 56.39,30.63 56.39,31.7 | 41.91,49.38 42.32,49.38 43.59,50.64 48.27,50.64 48.92,49.99 48.92,44.9 46.99,42.98 46.99,31.64 47.85,30.79 | v70.41,13.26 69.34,13.26 69.04,12.95
  Top 0.406: 35.65,51.82 35.55,51.9 DRV8300D1.SHB
  Bottom 0.152: 88.85,13.11 ML-300-3P1.P$3
  Bottom 0.305: 88.85,13.11 79.55,22.4 | 79.55,22.4 v77.11,24.84 | v70.41,13.26 79.55,22.4
SHC  (via drill 0.3)
  Top 0.152: Q5.1 56.39,22.55 56.39,21.49 Q5.2 56.39,21.34 56.39,20.27 Q5.3 | 56.08,20.42 56.24,20.27 Q5.3 | 48.16,20.42 C29.1 | 78.94,12.95 C4.2 79.1,12.8 | 77.11,18.9 Q6.5 | 77.11,20.12 Q6.6 77.11,20.27 | 77.11,21.49 Q6.7 77.11,21.34 | 77.11,22.55 Q6.8 | 74.77,20.57 Q6.9 74.68,20.88 | v38.41,49.99 34.9,49.99 DRV8300D1.SHC | 56.69,20.12 56.39,20.12 Q5.3
  Top 0.254: 63.59,52.27 58.88,52.27 | 56.69,20.12 57.45,19.36 57.45,18.29
  Top 0.305: 56.08,20.42 54.32,20.42 | 54.32,20.42 48.16,20.42 | 78.94,12.95 72.48,12.95 68.65,16.78 56.83,16.78 54.32,19.29 54.32,20.42 | 79.1,12.8 v80.31,11.58 | 77.11,22.55 77.11,21.49 | 77.11,21.34 77.11,20.88 | 77.11,20.88 77.11,20.27 | R25.2 59.76,55.38 58.88,54.5 58.88,53.65 | 58.88,52.27 58.88,53.65 | 63.59,52.27 72.39,43.48 72.39,37.64 69.34,34.59 69.34,19.36 69.09,19.11 | 69.09,19.11 70.06,18.14 72.33,18.14 74.77,20.57 | 58.88,53.65 v57.83,53.65 | 74.68,20.88 77.11,20.88 | 57.45,18.29 57.86,17.89 67.87,17.89 69.09,19.11
  Top 0.406: 77.11,20.12 77.11,18.9
  Bottom 0.152: 88.85,3.05 ML-300-3P1.P$5 | v38.41,49.99 54.17,49.99 v57.83,53.65
  Bottom 0.305: v80.31,11.58 88.85,3.05
VCC  (via drill 0.3)
  Top 0.152: 81.5,2.62 C10.1 81.53,2.74 | 66.75,5.94 U7.3 | 17.22,12.34 J7.2 | 88.54,46.02 C11.+ 88.54,45.87 | 88.54,33.07 C8.+ | 62.03,18.9 Q5.5 | 62.03,20.12 Q5.6 62.03,20.27 | 62.03,21.49 Q5.7 62.03,21.34 62.03,20.88 | 62.03,22.55 Q5.8 | 59.74,20.88 Q5.9 | 62.03,29.26 Q3.5 62.03,29.11 | 62.03,30.48 Q3.6 62.03,30.63 | 62.03,31.85 Q3.7 62.03,31.7 62.03,31.24 | 62.03,32.92 Q3.8 62.18,33.07 | 59.74,31.24 Q3.9 | 62.03,39.01 Q1.5 | 62.03,40.08 Q1.6 62.03,40.23 | 62.03,41.3 Q1.7 62.03,41.45 | 62.03,42.67 Q1.8 62.18,42.82 | 59.74,40.84 Q1.9 | v64.92,55.32 65.84,55.32 R26.2 | 42.06,55.32 R22.2
  Top 0.406: 81.5,2.62 79.54,0.66 67.42,0.66 66.5,1.58 | 66.75,5.94 66.75,1.83 66.5,1.58 | 17.22,12.34 20.64,12.34 31.96,1.02 65.95,1.02 66.5,1.58 | R35.2 90.65,55.28 91.83,54.1 91.83,51.38 88.54,48.09 88.54,46.02 | 88.54,45.87 88.54,33.07 | 62.03,20.12 62.03,18.9 | 62.03,22.55 62.03,21.49 | 62.03,20.27 62.03,20.88 59.74,20.88 | 62.03,30.48 62.03,29.26 | 62.03,32.92 62.03,31.85 | 62.03,30.63 62.03,31.24 59.74,31.24 | 62.03,29.11 Q5.8 | 62.03,40.08 62.03,39.01 | 62.03,40.23 62.03,40.84 | 62.03,40.84 62.03,41.3 | 62.03,41.45 62.03,42.67 | 59.74,40.84 62.03,40.84 | v43.28,55.32 42.06,55.32 | v62.18,50.86 62.18,42.82 | v62.18,37.19 62.18,33.07 | 81.53,2.74 84.36,2.74 v91.98,10.36
  Bottom 0.152: 88.39,46.02 C11.+ | 88.54,32.92 C8.+
  Bottom 0.305: 62.18,55.32 v62.18,50.86
  Bottom 0.406: v43.28,55.32 62.18,55.32 v64.92,55.32 66.99,55.32 68.67,53.65 68.67,49.6 | v62.18,37.19 62.18,43.11 68.67,49.6 | 88.39,46.02 72.24,46.02 68.67,49.6 | v91.98,10.36 91.98,29.48 88.54,32.92
VIOUT
  Top 0.152: U$1.12 25.91,30.94 15.24,30.94 13.26,28.96 9.75,28.96 7.16,31.55 7.16,40.54 8.03,41.41 JP1.2

### Text on the board
tPlace: BLDC_test1 | suzuki 2023_03